# EAGLE schematic VCOBoard (EAGLE 9.2.1)
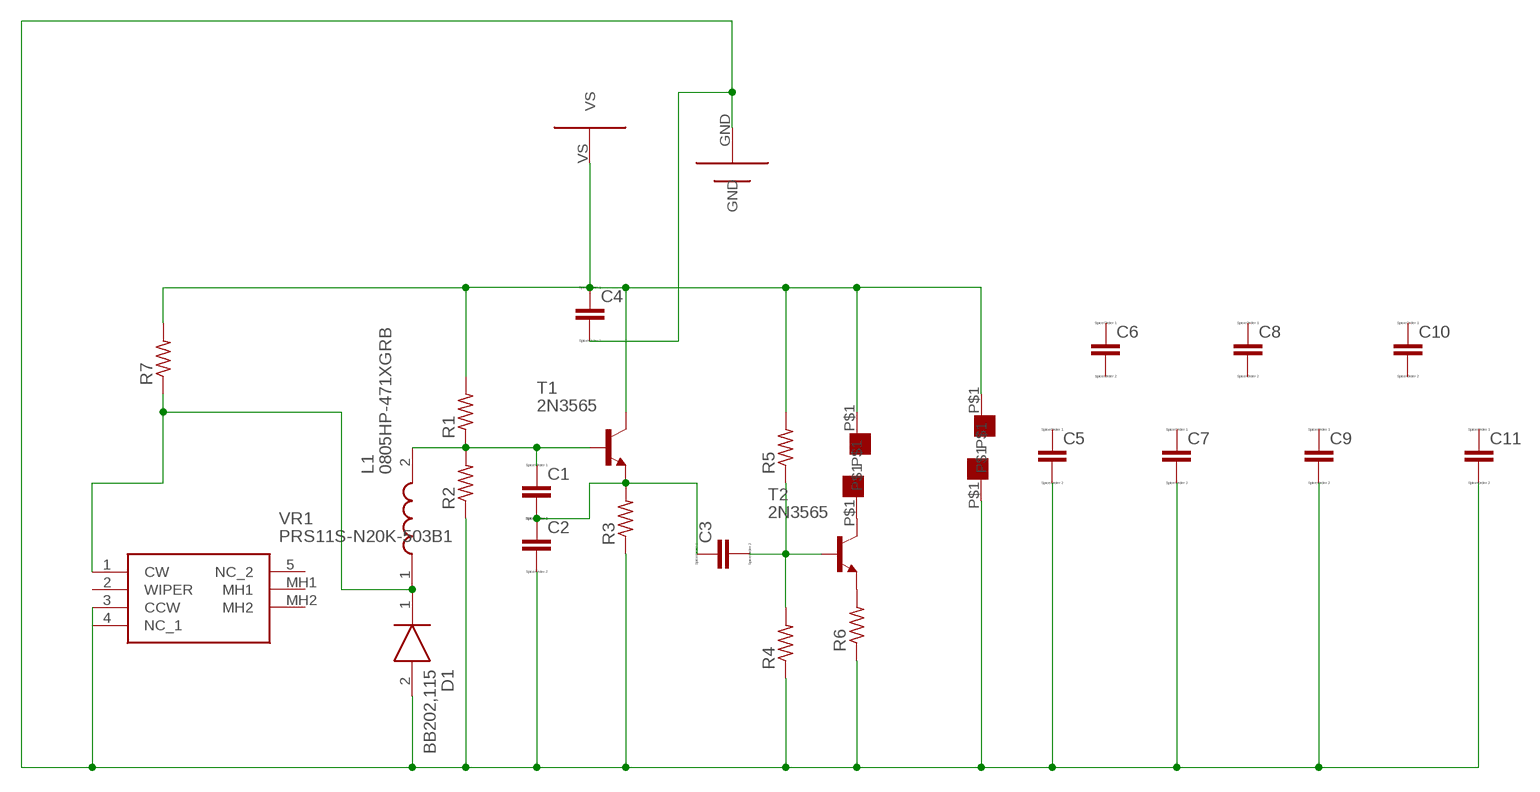
[diagram p0: schematic, sheet 1]

## Parts
C1  C  [C0805]
C2  C  [C0805]
C3  C  [C0805]
C4  C  [C0805]
C5  C  [C0805]
C6  C  [C0805]
C7  C  [C0805]
C8  C  [C0805]
C9  C  [C0805]
C10  C  [C0805]
C11  C  [C0805]
D1  BB202,115  [SODFL1608X65N]
L1  0805HP-471XGRB  [INDPM2217X155N]
R1  R-US_R0805  [R0805]
R2  R-US_R0805  [R0805]
R3  R-US_R0805  [R0805]
R4  R-US_R0805  [R0805]
R5  R-US_R0805  [R0805]
R6  R-US_R0805  [R0805]
R7  R-US_R0805  [R0805]
T1  2N3565  [TO92]
T2  2N3565  [TO92]
U$1  PAD  [PAD]
U$2  PAD  [PAD]
U$3  PAD  [PAD]
U$4  PAD  [PAD]
U$5  ALLIGATORCLIPS  [ALLIGATORCONNECTOR]
VR1  PRS11S-N20K-503B1  [PRS11SN20K503B1]

## Nets
N$1: R6.2 T2.3(E)
N$2: C4.1 R1.2 R5.2 R7.2 T1.1(C) U$2.P$1 U$3.P$1 U$5.VS
N$3: C1.2 C2.1 C3.1 R3.2 T1.3(E)
N$4: C1.1 L1.2 R1.1 R2.2 T1.2(B)
N$5: C3.2 R4.2 R5.1 T2.2(B)
N$6: C2.2 C4.2 C5.2 C7.2 C9.2 C11.2 D1.2(A) R2.1 R3.1 R4.1 R6.1 U$4.P$1 U$5.GND VR1.3(CCW)
N$7: T2.1(C) U$1.P$1
N$8: D1.1(K) L1.1 R7.1 VR1.1(CW)
Unconnected: C5.1 C6.1 C6.2 C7.1 C8.1 C8.2 C9.1 C10.1 C10.2 C11.1 VR1.2(WIPER) VR1.4(NC_1) VR1.5(NC_2) VR1.MH1 VR1.MH2

## Library data of the parts
C1-C11 = eagle-ltspice:C: CAPACITOR, European symbol; SPICEMODEL: NONE; SPICEPREFIX: C
D1 = SamacSys_Parts:BB202,115: NXP BB202,115 Varactor, 28.2pF min, 2.5:1 Tuning Ratio, 6V, 2-Pin SOD-523 Source: Datasheet <https://www.mouser.com/datasheet/2/302/BB202_N-1126067.pdf>; DESCRIPTION: NXP BB202,115 Varactor, 28.2pF min, 2.5:1 Tuning Ratio, 6V, 2-Pin SOD-523; HEIGHT: 0.65mm; MANUFACTURER_NAME: NXP; MANUFACTURER_PART_NUMBER: BB202,115; MOUSER_PART_NUMBER: 771-BB202-T/R
L1 = SamacSys_Parts:0805HP-471XGRB: Fixed Inductors 470nH 2% 0.28A DCR=1.559Ohms Source: Datasheet <https://componentsearchengine.com/Datasheets/1/0805HP-471XGRB.pdf>; DESCRIPTION: Fixed Inductors 470nH 2% 0.28A DCR=1.559Ohms; HEIGHT: 1.55mm; MANUFACTURER_NAME: COILCRAFT; MANUFACTURER_PART_NUMBER: 0805HP-471XGRB; MOUSER_PART_NUMBER: 994-0805HP-471XGRB; MOUSER_PRICE-STOCK: https://www.mouser.com/Search/Refine.aspx?Keyword=994-0805HP-471XGRB
R1-R7 = resistor:R-US_: RESISTOR, American symbol
T1 T2 = transistor:2N3565: NPN TRANSISTOR
U$1-U$4 = Custom:PAD
U$5 = Custom:ALLIGATORCLIPS
VR1 = SamacSys_Parts:PRS11S-N20K-503B1: Res Carbon Film POT 50K Ohm 20% 0.05W(1/20W) 1(Elec)/1(Mech)Turn 6mm (11.7 X 18.5 X 21.4mm) Gull Wing SMD Tube Source: Datasheet <https://componentsearchengine.com/Datasheets/1/PRS11S-N20K-503B1.pdf>; DESCRIPTION: Res Carbon Film POT 50K Ohm 20% 0.05W(1/20W) 1(Elec)/1(Mech)Turn 6mm (11.7 X 18.5 X 21.4mm) Gull Wing SMD Tube; HEIGHT: 20mm; MANUFACTURER_NAME: Bourns; MANUFACTURER_PART_NUMBER: PRS11S-N20K-503B1; MOUSER_PART_NUMBER: 652-PRS11SN20K503B1; MOUSER_PRICE-STOCK: https://www.mouser.com/Search/Refine.aspx?Keyword=652-PRS11SN20K503B1